# EAGLE schematic board_stm32 (EAGLE 9.6.2)
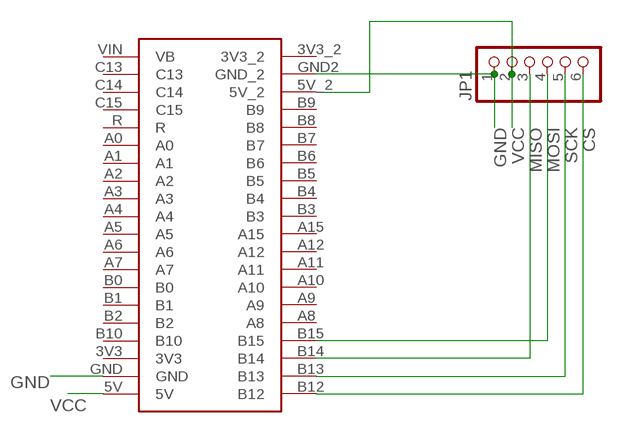
[diagram p0: schematic, sheet 1]

## Parts
JP1  PINHD-1X6  [1X06]
U$1  STM32F411CEU6  [STM32F411CEU6]

## Nets
CS: JP1.6 U$1.B12
GND: JP1.1 U$1.GND U$1.GND2(GND_2)
MISO: JP1.3 U$1.B14
MOSI: JP1.4 U$1.B15
SCK: JP1.5 U$1.B13
VCC: JP1.2 U$1.5V U$1.5V_2
Unconnected: U$1.3V3 U$1.3V3_2 U$1.A0 U$1.A1 U$1.A2 U$1.A3 U$1.A4 U$1.A5 U$1.A6 U$1.A7 U$1.A8 U$1.A9 U$1.A10 U$1.A11 U$1.A12 U$1.A15 U$1.B0 U$1.B1 U$1.B2 U$1.B3 U$1.B4 U$1.B5 U$1.B6 U$1.B7 U$1.B8 U$1.B9 U$1.B10 U$1.C13 U$1.C14 U$1.C15 U$1.R U$1.VIN(VB)

## Library data of the parts
JP1 = adafruit:PINHD-1X6: PIN HEADER
U$1 = STM32F411CEU6:STM32F411CEU6